# Altium schematic sheet Sheet1.SchDoc
size B
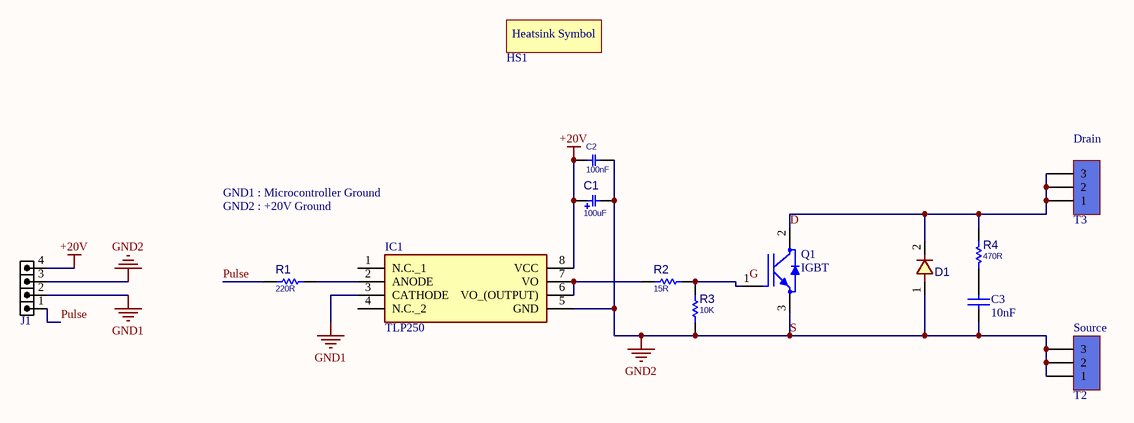
[diagram p0: Sheet1.SchDoc]

## Parts
C1  100uF  [C_EL_8X12]
C2  100nF  [C_CER_D3]
C3  10nF  [Cap-10nF-630V]
D1  1N4007  [D_AX04_DO41]  (value not drawn)
HS1  Symbol to use Heatsink on pcb  [HSINK_TO220A]  (value not drawn)
IC1  TLP250  [DIP762W50P254L966H445Q8N]
J1  HDR1X4  [HDR_M_1X4]  (value not drawn)
Q1  IGBT  [TO247_3]
R1  220R  [R025W_AX04]
R2  15R  [R05W_AX05]
R3  10K  [R025W_AX04]
R4  470R  [R1W_AX06]
T2  KF301_Terminal  [KF301 3PIN]  (value not drawn)
T3  KF301_Terminal  [KF301 3PIN]  (value not drawn)

## Nets
+20V: C1.1 C2.1 IC1.8(VCC) J1.4
GND1: IC1.3(CATHODE) J1.2
S: C1.2 C2.2 C3.1 D1.1 IC1.5(GND) J1.3 Q1.3(E) R3.1 T2.1 T2.2 T2.3  [also labelled GND2]
D: D1.2 Q1.2(C) R4.2 T3.1 T3.2 T3.3
Pulse: J1.1 R1.1
NetC3_2: C3.2 R4.1
NetIC1_2: IC1.2(ANODE) R1.2
NetIC1_6: IC1.6(VO_(OUTPUT)) IC1.7(VO) R2.1
NetQ1_1: Q1.1(G) R2.2 R3.2

Not connected (* = marked no-connect by the designer): IC1 1(N.C._1) 4(N.C._2)

## Notes on the sheet
- GND1 : Microcontroller Ground
- (near T3) Drain
- GND2 : +20V Ground
- (near T2) Source
- Labels drawn without touching a wire or pin: G
- (in symbol Heatsink) Heatsink Symbol

## Library data of the parts
C1 = CAP_THD_EL: CAP, THD, ELEC,; MANF_P#: MANF_PART#; PARAM2: 20%; DESC: DESCRIPTION; DIST#: MOUSER; PARAM: 25V; PRICE: 10= 5$; MANF: MANF; ASSEMBLY: ASSEMBLY; VALUE: 100uF
C2 = CAP_THD_CERML: CAP, THD, CER MULTI LAYER,; PARAM: 50V; DESC: CAP, CER MULTI LAYER,; MANF_P#: MANF_PART#; PRICE: 100= 1$; MANF: MANF; PARAM2: PARAM2; ASSEMBLY: ASSEMBLY; VALUE: 100nF
C3 = CAP CERAMIC TOTAL SIZE: CAP Ceramic Total; Designer: Ali Hafizi
D1 = DIODE_THD_1N4007: DIODE, GENERAL PURPOSE, 1000V/1A; MANF: Diodes; DESC: DESCRIPTION; PARAM: 1000V, 1.15V; PARAM2: 1.5A; ASSEMBLY: ASSEMBLY; PRICE: PRICE; MANF_P#: 1N4007; VALUE: 1N4007
HS1 = Heatsink
IC1 = TLP250: Integrated Circuit; Manufacturer_Name: Toshiba; Datasheet Link: http://toshiba.semicon-storage.com/info/docget.jsp?did=16821&prodName=TLP250; Height: 4.45mm; Manufacturer_Part_Number: TLP250; RS Part Number: 0768100; RS Price/Stock: http://uk.rs-online.com/web/p/products/0768100
J1 = HDR_M_1X4: CONN, HEADER, Male, pitch: 2.54mm, 4POS; VALUE: HDRM4
Q1 = IGBT: MF: ON Semiconductor; MP: FGH40N60SFDTU; Value: *; SnapEDA_Link: https://www.snapeda.com/parts/FGH40N60SFDTU/ON%20Semiconductor/view-part/405516/?ref=snap; Package: TO-247 Fairchild Semiconductor; Price: None; Availability: Unavailable
R1-R4 = RES_THD: RESISTOR, THD; MANF_P#: RK73H1ETTP4701F; MANF: KOA SPEER; PARAM: 0.063W; DESC: DESCRIPTION; DIST#: MOUSER; PARAM2: 1%; ASSEMBLY: ASSEMBLY; PRICE: 100= 0.5$
  R1: VALUE: 220R
  R2: VALUE: 15R
  R3: VALUE: 10K
  R4: VALUE: 470R
T2 T3 = KF301-3Pin_Terminal: Terminal 3 Pin 250VAC 16A; Part. No: KF301 3P; Designer: Abbas Basereh; Link: https://www.aliexpress.com/item/